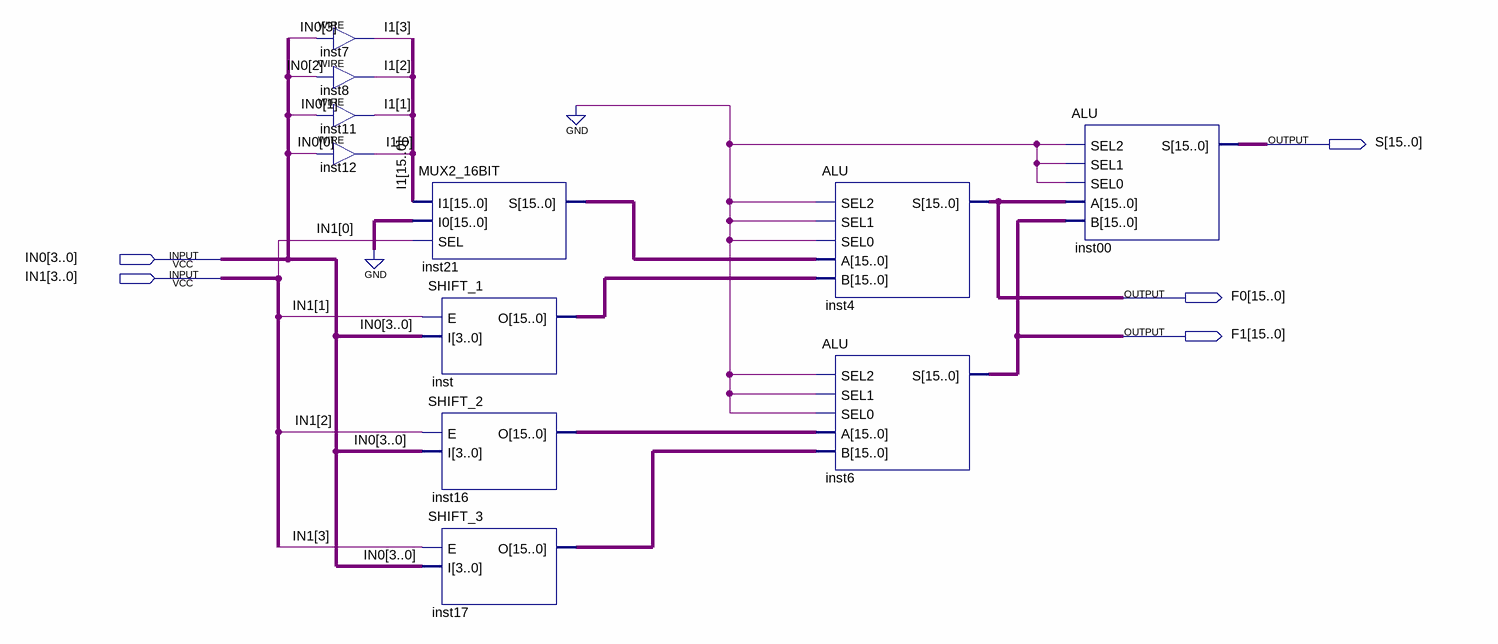
[diagram p0: schematic sheet]
// Quartus schematic NHAN4BIT.bdf as structural Verilog: 11 symbols, 5 pins
module NHAN4BIT (
  input  [3:0] IN0,
  input  [3:0] IN1,
  output [15:0] S,
  output [15:0] F0,
  output [15:0] F1
);

  wire [15:0] I1, inst16_o, inst17_o, inst21_s, inst_o;

  assign I1[3] = IN0[3];  // WIRE inst7
  assign I1[2] = IN0[2];  // WIRE inst8
  assign I1[1] = IN0[1];  // WIRE inst11
  assign I1[0] = IN0[0];  // WIRE inst12
  MUX2_16BIT inst21 (.I1(I1), .I0({16{1'b0}}), .SEL(IN1[0]), .S(inst21_s));
  SHIFT_1 inst (.E(IN1[1]), .I(IN0), .O(inst_o));
  SHIFT_2 inst16 (.E(IN1[2]), .I(IN0), .O(inst16_o));
  SHIFT_3 inst17 (.E(IN1[3]), .I(IN0), .O(inst17_o));
  ALU inst4 (.SEL2(1'b0), .SEL1(1'b0), .SEL0(1'b0), .A(inst21_s), .B(inst_o), .S(F0));
  ALU inst6 (.SEL2(1'b0), .SEL1(1'b0), .SEL0(1'b0), .A(inst16_o), .B(inst17_o), .S(F1));
  ALU inst00 (.SEL2(1'b0), .SEL1(1'b0), .SEL0(1'b0), .A(F0), .B(F1), .S(S));
endmodule
